# EAGLE board Tello_Power_PCB (EAGLE 9.6.2)
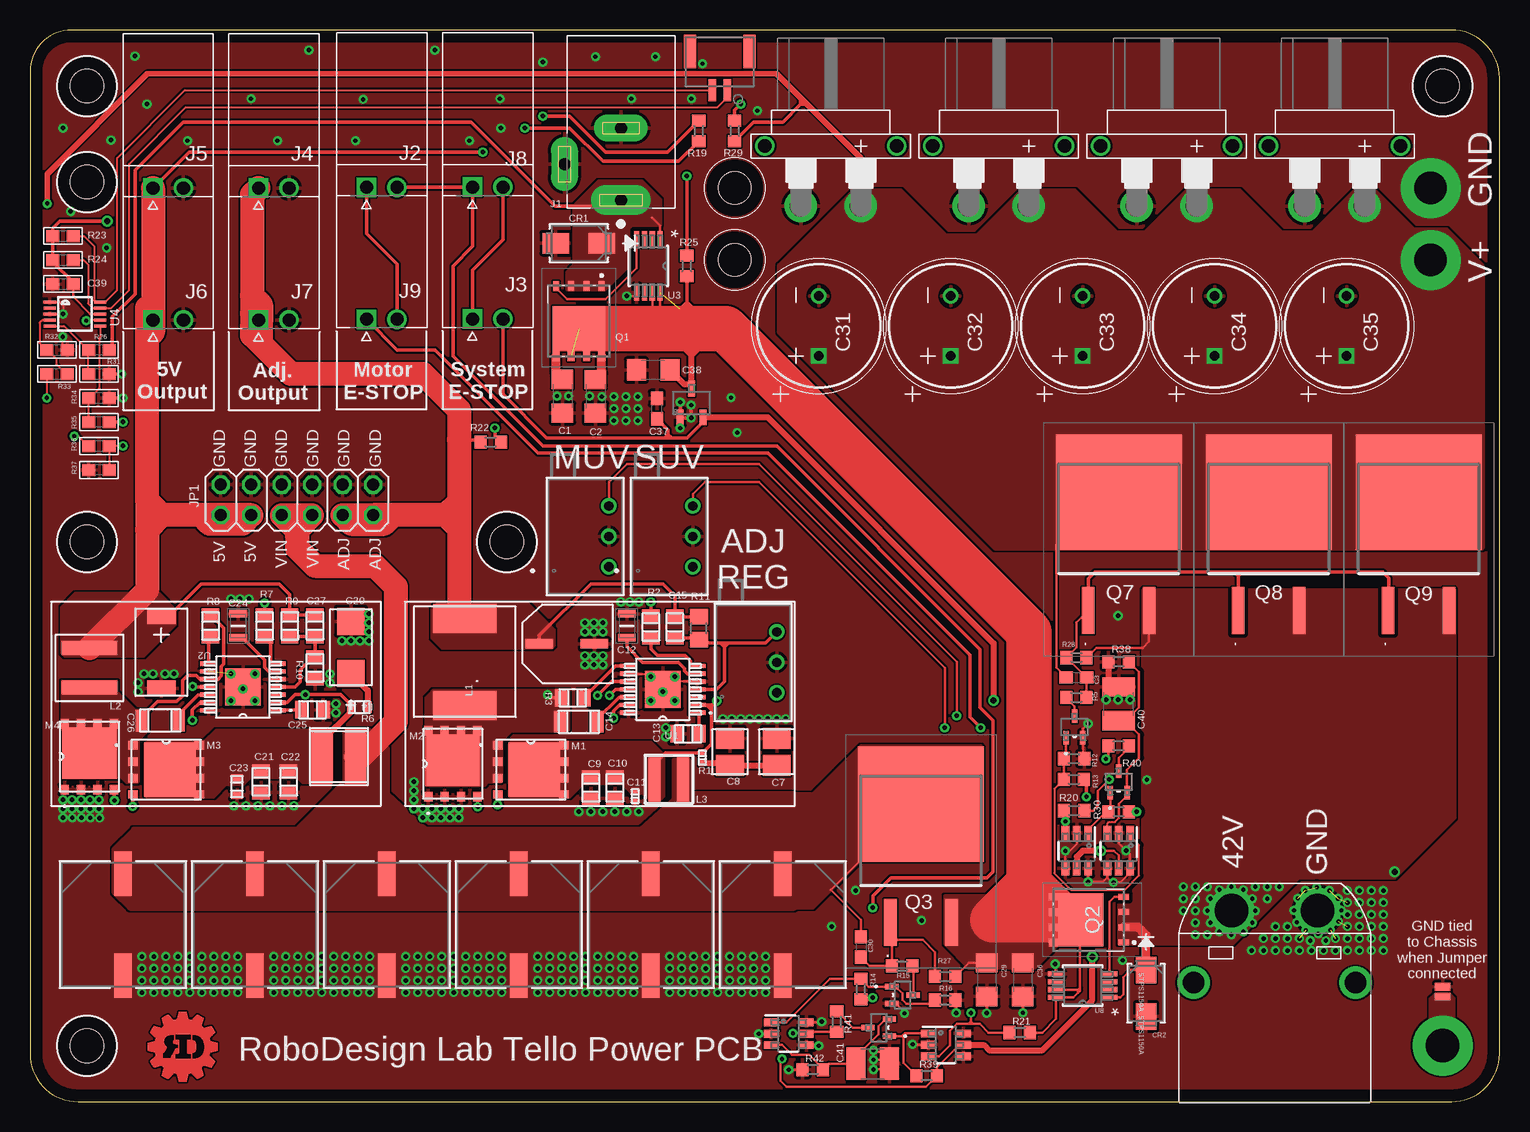
[diagram p6: board, top side]
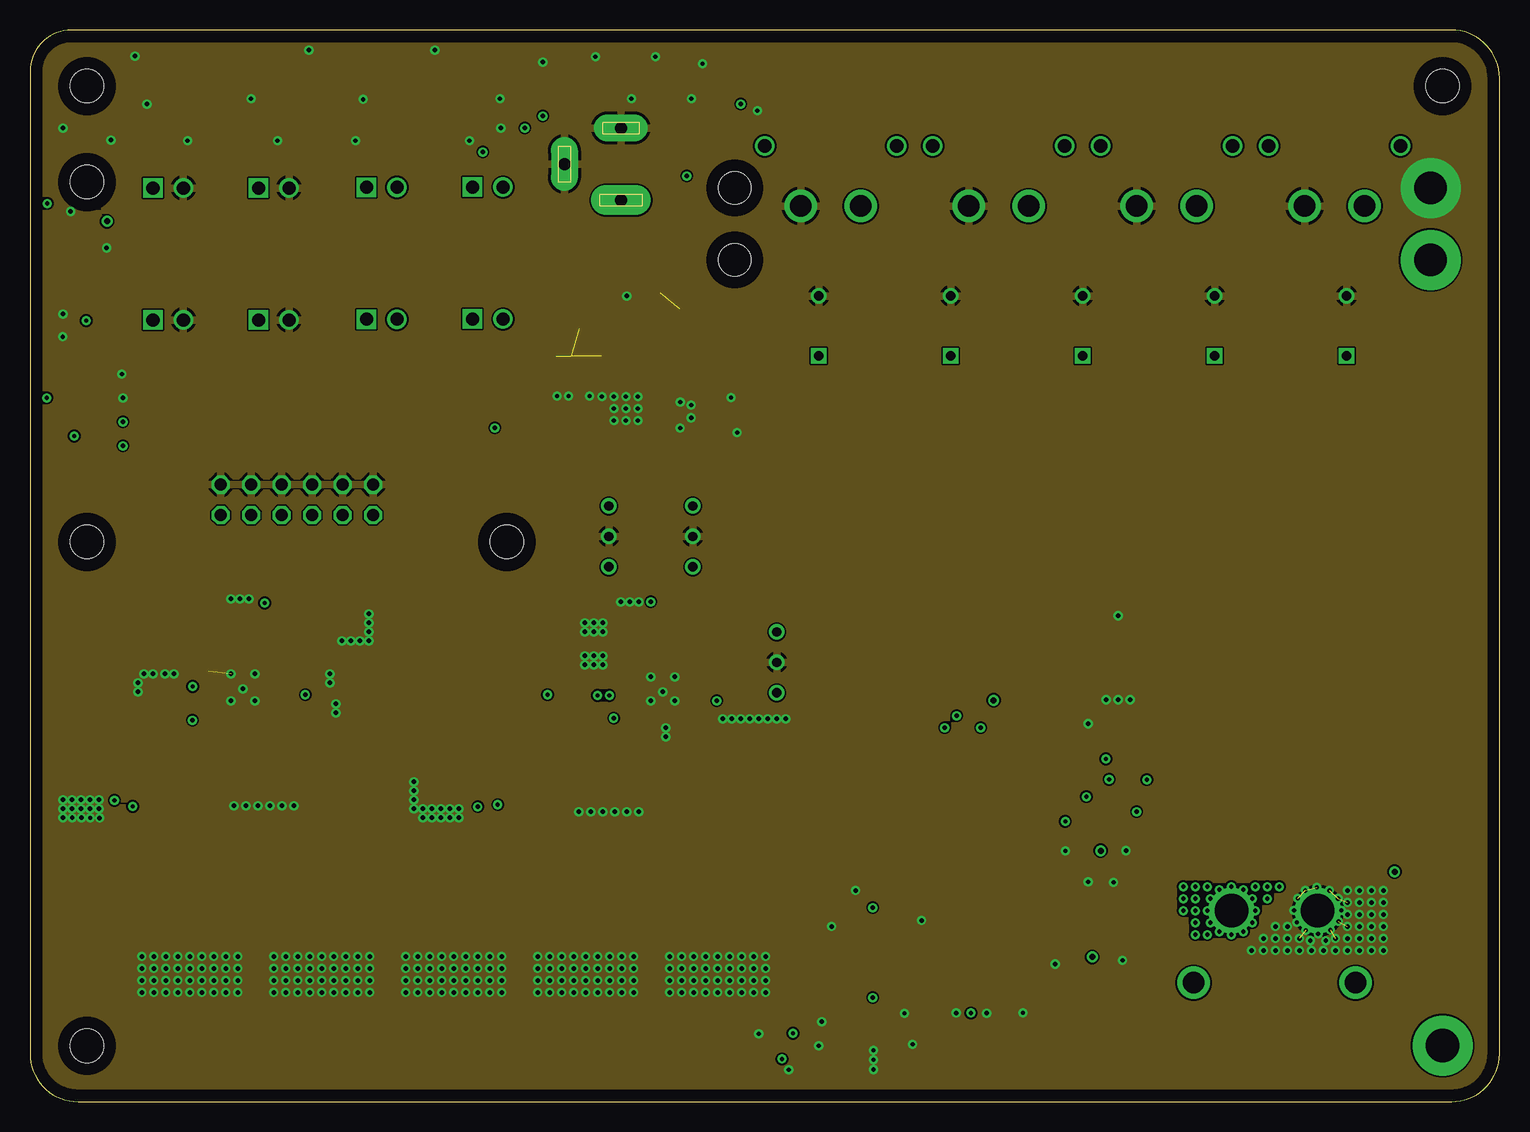
[diagram p7: board, inner layer Route2]
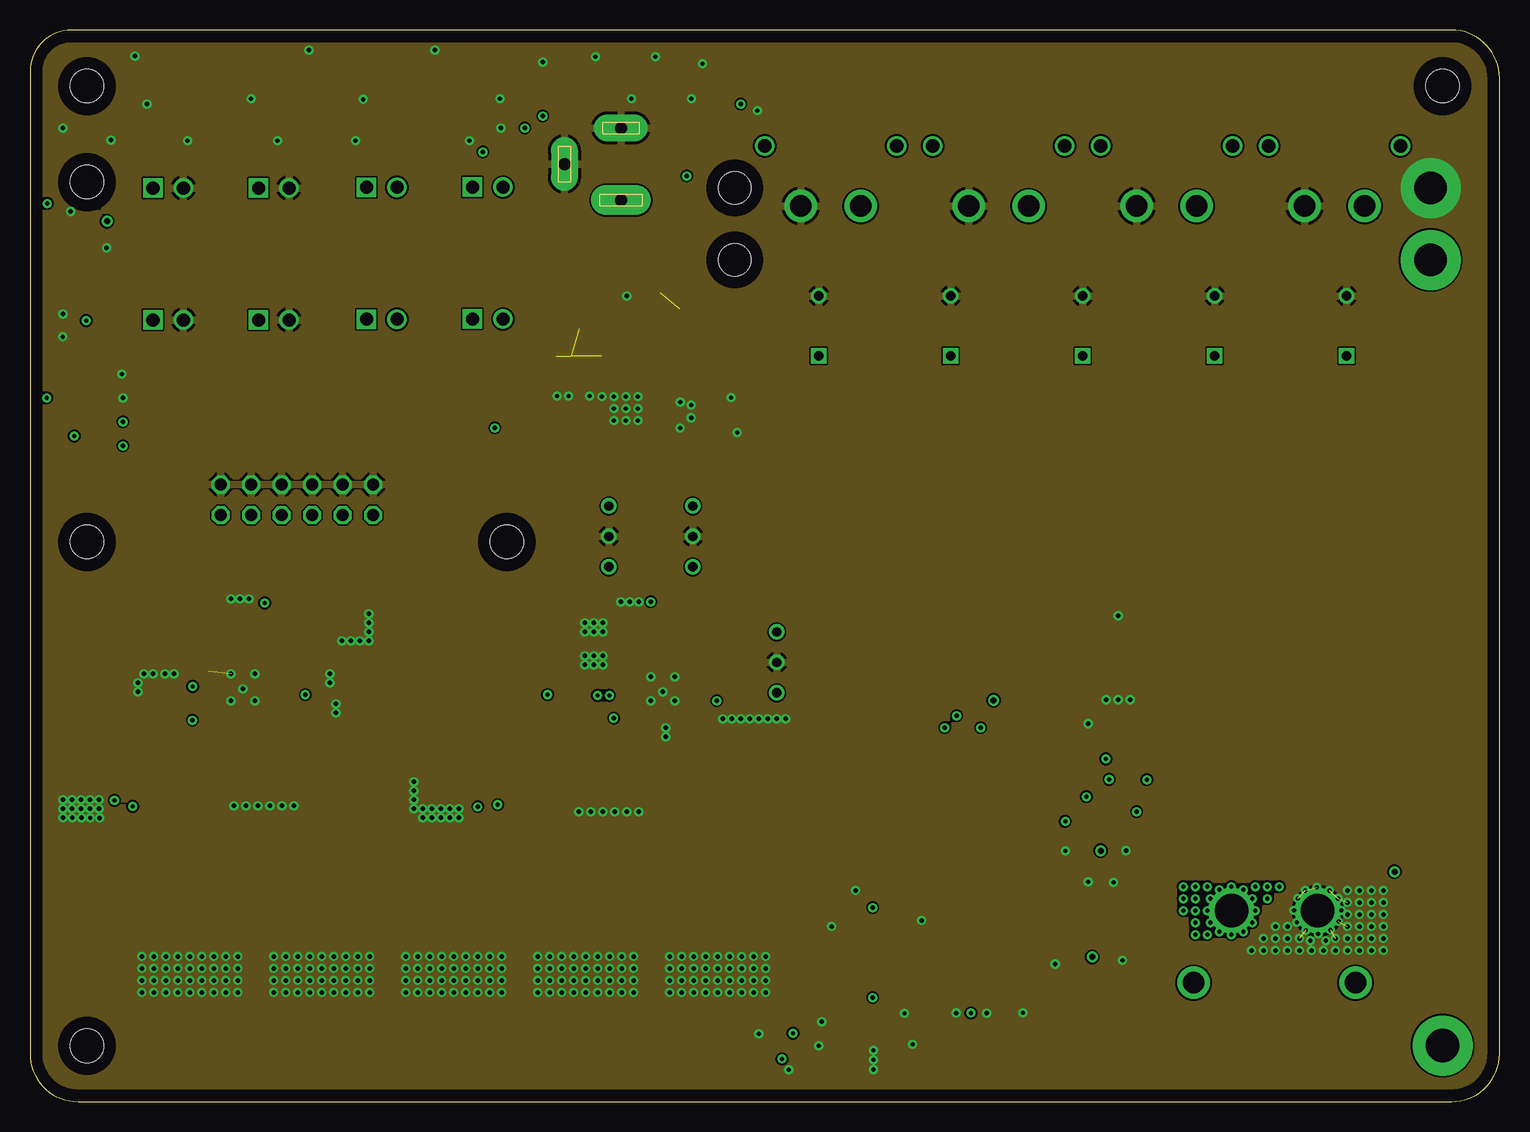
[diagram p8: board, inner layer Route15]
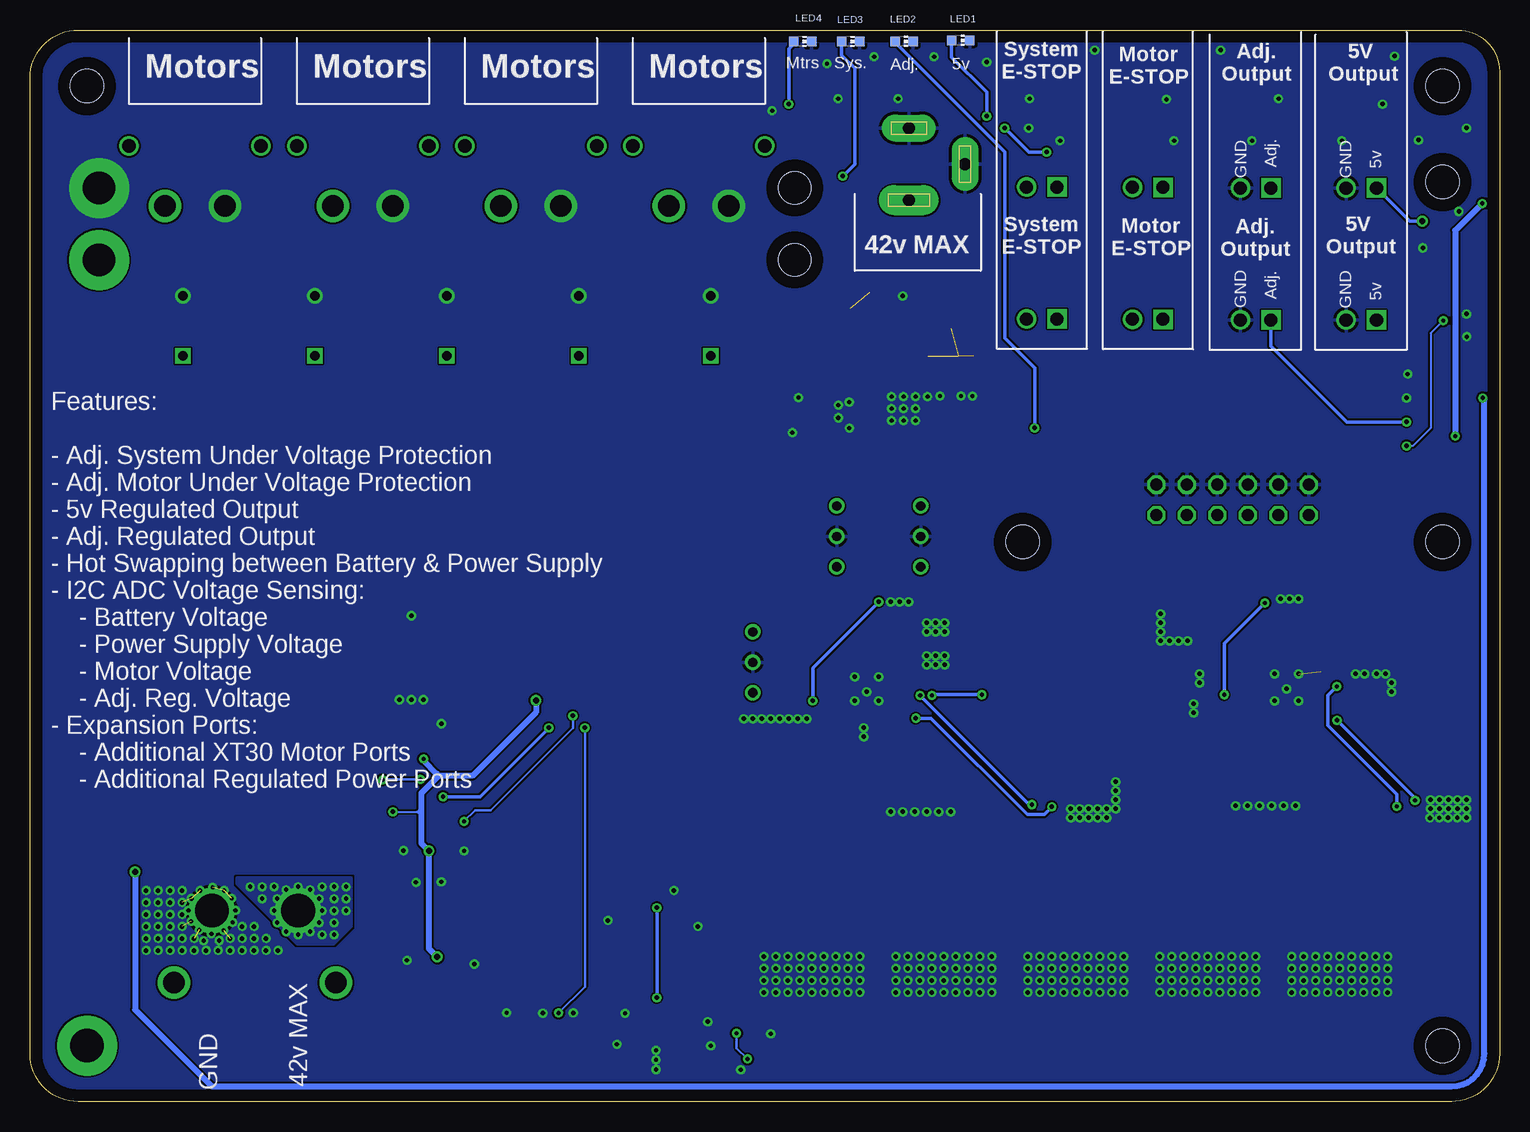
[diagram p9: board, bottom side, seen from below]

Size 122.5 x 89.35 mm. Coordinates in mm from the lower left corner, seen from the top.
Outline: 4,0 118.5,0 arc90 122.5,4 122.5,85.35 arc90 118.5,89.35 3.47,89.35 arc90 0,85.88 0,4 arc90 4,0
Copper layers (1+2*15+16): Top 0.035mm / dielectric 1.5mm / Route2 0.035mm / dielectric 0.15mm / Route15 0.035mm / dielectric 0.2mm / Bottom 0.035mm
Design rules "default *": minimum track width 6mil, minimum drill 0.35mm, track to track 6mil, track to pad 6mil, pad to pad 6mil, via to via 6mil, smd to smd 6mil, copper to edge 40mil, drill to drill 6mil, minimum pad ring 10mil, minimum via ring 8mil, stop-mask expansion 4mil, vias tented up to drill 20mil, thermal gap 10mil
Holes 2.8 mm at 4.75,84.67 117.75,84.67 4.75,4.67 4.75,76.67 4.75,46.67 39.75,46.67
Holes 2.7 mm at 58.75,70.17 58.75,76.17

## Footprints (pad centres in the part's own frame; a part is rotated, then mirrored left to right if it is on the bottom)
RCL_C1206 = smd 1.6 x 1.8: 1 -1.4,0; 2 1.4,0
RCL_C0603 = smd 1.1 x 1: 1 -0.85,0; 2 0.85,0
PCR1H820MCL1GS_CAP_PC_10X8_NCH = smd 3.702 x 1.492: 1 -4.25,0; 2 4.25,0
12V--LM3150_3528-21 = smd 1.753 x 2.311: 1 -1.13,0; 2 1.13,0
12V--LM3150_0805:1 = smd 1.118 x 1.448: 1 -0.902,0; 2 0.902,0
12V--LM3150_0402 = smd 0.559 x 0.61: 1 -0.419,0; 2 0.419,0
CGA4F2C0G1H153J085AA_CAPC2012X100N = smd 0.62 x 1.47: 1 -1,0; 2 1,0
12V--LM3150_1206:1 = smd 1.118 x 1.803: 1 -1.499,0; 2 1.499,0
12V--LM3150_PCV1E330MCL1GS = smd 2.3 x 0.8: P$1 2.3,0; P$3 -2.3,0
5V-LM3150MH_6032-28 = smd 2.261 x 2.311: 1 -2.172,0; 2 2.172,0
5V-LM3150MH_0805 = smd 1.118 x 1.448: 1 -0.902,0; 2 0.902,0
5V-LM3150MH_0603 = smd 0.66 x 0.965: 1 -0.699,0; 2 0.699,0
5V-LM3150MH_1206 = smd 1.118 x 1.803: 1 -1.499,0; 2 1.499,0
5V-LM3150MH_C2917 = smd 1.3 x 2.4: P$1 0,0; P$2 6,0
227AVG050MGBJ_CAPPRD500W60D1025H1350 = drill 0.8 pad 1.2 square: 1 0,0 | drill 0.8 pad 1.2: 2 5,0
MICROBUILDER_0603:1 = smd 1.1 x 1: 1 -0.85,0; 2 0.85,0
RCL_C1210 = smd 1.6 x 2.7: 1 -1.4,0; 2 1.4,0
AMASS_XT30PW-F = drill 1.8: + 2.5,0; - -2.5,0 | drill 1.1: P$3 -5.5,5; P$4 5.5,5
AMASS_XT60PW-M = drill 2.8: + 3.6,0; - -3.6,0 | drill 1.8: P$3 -6.75,6; P$4 6.75,6
STPS1150A_SMA_STM = smd 2.21 x 1.702: 1 -1.93,0; 2 1.93,0
PJ-002A_CUI_PJ-002A = drill 1 pad 2.5 long: 1 0,0 | drill 1 pad 2.25 long: 2 6,0; 3 3,4.7
1719740002_MOLEX_1719740002 = drill 1.09 pad 1.44 square: 1 0,0 | drill 1.09 pad 1.44: 2 -2.54,0
SM02B-GHS-TB_CONN_SM02BGHSTB_JST = smd 0.66 x 1.803: 1 -0.625,2.345; 2 0.625,2.345 | smd 0.991 x 2.794: 3 -2.475,-0.865; 4 2.475,-0.865
PINHEAD_2X06 = drill 1.016 octagon: 1 -6.35,-1.27; 2 -6.35,1.27; 3 -3.81,-1.27; 4 -3.81,1.27; 5 -1.27,-1.27; 6 -1.27,1.27; 7 1.27,-1.27; 8 1.27,1.27; 9 3.81,-1.27; 10 3.81,1.27; 11 6.35,-1.27; 12 6.35,1.27
SPARKFUN-JUMPERS_SMT-JUMPER_2_NC_PASTE_NO-SILK = smd 0.635 x 1.27: 1 -0.406,0; 2 0.406,0
12V--LM3150_WE-LHMI_8040 = smd 2.42 x 5.33: 1 -3.62,0; 2 3.62,0
5V-LM3150MH_XAL5030 = smd 1.168 x 4.648: 1 -1.651,0; 2 1.651,0
XAL4030-332MEB_XAL4030-332MEB = smd 0.98 x 3.7: 1 -1.185,0; 2 1.185,0
5V-LM3150MH_IND_NPI43C = smd 1.753 x 4.496: 1 -1.397,0; 2 1.397,0
LED_CHIP-LED0603 = smd 0.8 x 0.8: A 0,-0.75; C 0,0.75
12V--LM3150_TRANS_NEXFET_Q5A:1 = smd 0.8 x 0.7: 1 -2.752,2.055; 2 -2.752,0.685; 3 -2.752,-0.685; 4 -2.752,-2.055; 5 2.752,-2.055; 6 2.752,-0.685; 7 2.752,0.685; 8 2.752,2.055 | smd 4.3 x 4.56: 9 0.3,0
5V-LM3150MH_TRANS_NEXFET_Q5A = smd 0.8 x 0.7: 1 -2.752,2.055; 2 -2.752,0.685; 3 -2.752,-0.685; 4 -2.752,-2.055; 5 2.752,-2.055; 6 2.752,-0.685; 7 2.752,0.685; 8 2.752,2.055 | smd 4.3 x 4.56: 9 0.3,0
BSC027N06LS5ATMA1_BSC027N06LS5ATMA1 = smd 0.5 x 0.85: 1 -1.905,-2.913; 2 -0.635,-2.913; 3 0.635,-2.913; 4 1.905,-2.913 | smd 0.6 x 0.8: 5 1.905,2.913; 6 0.635,2.913; 7 -0.635,2.913; 8 -1.905,2.913 | smd 4.41 x 3.75: 9 0,0.637
IXTA96P085T_IXTA96P085T = smd 3.95 x 1.05: 1 -12.221,2.54; 3 -12.221,-2.54 | smd 9.6 x 10.5: 4 -2.371,0
68XR10KLF_RES3_68X_TTE = drill 0.762 pad 1.27: 1 5.08,0; 2 2.54,0; 3 0,0
RCL_R0603 = smd 1 x 1.1: 1 -0.85,0; 2 0.85,0
RCL_R0805 = smd 1.3 x 1.5: 1 -0.95,0; 2 0.95,0
5V-LM3150MH_MXA14A = smd 1.422 x 0.356: 1 -2.845,1.95; 2 -2.845,1.3; 3 -2.845,0.65; 4 -2.845,0; 5 -2.845,-0.65; 6 -2.845,-1.3; 7 -2.845,-1.95; 8 2.845,-1.95; 9 2.845,-1.3; 10 2.845,-0.65; 11 2.845,0; 12 2.845,0.65; 13 2.845,1.3; 14 2.845,1.95 | smd 2.997 x 3.099: 15 0,0
LTC4357_MSOP-8_MS_LIT = smd 1.359 x 0.432: 1 -2.229,0.975; 2 -2.229,0.325; 3 -2.229,-0.325; 4 -2.229,-0.975; 5 2.229,-0.975; 6 2.229,-0.325; 7 2.229,0.325; 8 2.229,0.975
MICROBUILDER_MSOP10 = smd 0.25 x 1: 1 -1,-2.113; 2 -0.5,-2.113; 3 0,-2.113; 4 0.5,-2.113; 5 1,-2.113; 6 1,2.113; 7 0.5,2.113; 8 0,2.113; 9 -0.5,2.113; 10 -1,2.113
DMN67D8LW-13_DMN67D8LW-13_DIO = smd 0.457 x 1.118: 1 -0.7,-0.897; 2 0.7,-0.897; 3 0,0.897
TLV6713DDC_DDC0006A_M = smd 1.2 x 0.65: GND 1.475,0.95; GND@1 1.475,-0.95; GND@2 -1.475,0; OUT -1.475,0.95; SENSE -1.475,-0.95; VCC 1.475,0
MCP1792T-5002H_SOT-23A_CB_MCH = smd 0.568 x 1.31: 1 -0.95,-1.194; 2 0.95,-1.194; 3 0,1.194

## Placement (x,y rotation side)
C1  10uF 50v  [RCL_C1206]  44.39,58.82 270 top
C2  10uF 50v  [RCL_C1206]  47.13,58.8 270 top
C3  47nF  [RCL_C0603]  87.23,35.35 0 top
C4  PCR1H820MCL1GS_PCR1H820MCL1GS  [PCR1H820MCL1GS_CAP_PC_10X8_NCH]  7.75,14.77 270 top
C5  PCR1H820MCL1GS_PCR1H820MCL1GS  [PCR1H820MCL1GS_CAP_PC_10X8_NCH]  18.75,14.77 270 top
C6  PCR1H820MCL1GS_PCR1H820MCL1GS  [PCR1H820MCL1GS_CAP_PC_10X8_NCH]  29.75,14.77 270 top
C7  2.2uF  [12V--LM3150_3528-21]  62.25,29.17 90 top
C8  2.2uF  [12V--LM3150_3528-21]  58.35,29.17 90 top
C9  15uF  [12V--LM3150_0805:1]  46.75,26.17 270 top
C10  15uF  [12V--LM3150_0805:1]  48.75,26.17 270 top
C11  100nF  [12V--LM3150_0402]  50.45,25.47 270 top
C12  15nF  [CGA4F2C0G1H153J085AA_CAPC2012X100N]  49.75,39.67 90 top
C13  2.2uF  [12V--LM3150_0805:1]  54.85,30.67 180 top
C14  470nF  [12V--LM3150_1206:1]  45.75,31.67 180 top
C15  300pF  [12V--LM3150_0805:1]  53.75,39.57 270 top
C16  30.073uF 58.181mOhm  [12V--LM3150_PCV1E330MCL1GS]  44.75,38.17 180 top
C17  PCR1H820MCL1GS_PCR1H820MCL1GS  [PCR1H820MCL1GS_CAP_PC_10X8_NCH]  40.75,14.77 270 top
C18  PCR1H820MCL1GS_PCR1H820MCL1GS  [PCR1H820MCL1GS_CAP_PC_10X8_NCH]  51.75,14.77 270 top
C19  PCR1H820MCL1GS_PCR1H820MCL1GS  [PCR1H820MCL1GS_CAP_PC_10X8_NCH]  62.75,14.77 270 top
C20  3.3uF  [5V-LM3150MH_6032-28]  26.75,37.88 90 top
C21  10uF  [5V-LM3150MH_0805]  19.25,26.67 270 top
C22  10uF  [5V-LM3150MH_0805]  21.55,26.67 270 top
C23  100nF  [5V-LM3150MH_0603]  17.25,26.27 270 top
C24  15nF  [CGA4F2C0G1H153J085AA_CAPC2012X100N]  17.35,39.67 90 top
C25  2.2uF  [5V-LM3150MH_0805]  23.55,32.67 0 top
C26  470nF  [5V-LM3150MH_1206]  10.85,31.77 180 top
C27  62pF  [5V-LM3150MH_0805]  23.75,39.67 270 top
C28  EEF-CX0J151XR  [5V-LM3150MH_C2917]  10.95,40.47 270 top
C29  10uF 50v  [RCL_C1206]  79.75,10.17 270 top
C30  47nF  [RCL_C0603]  69.26,12.9 270 top
C31  227AVG050MGBJ_227AVG050MGBJ  [227AVG050MGBJ_CAPPRD500W60D1025H1350]  65.75,62.17 90 top
C32  227AVG050MGBJ_227AVG050MGBJ  [227AVG050MGBJ_CAPPRD500W60D1025H1350]  76.75,62.17 90 top
C33  227AVG050MGBJ_227AVG050MGBJ  [227AVG050MGBJ_CAPPRD500W60D1025H1350]  87.75,62.17 90 top
C34  227AVG050MGBJ_227AVG050MGBJ  [227AVG050MGBJ_CAPPRD500W60D1025H1350]  98.75,62.17 90 top
C35  227AVG050MGBJ_227AVG050MGBJ  [227AVG050MGBJ_CAPPRD500W60D1025H1350]  109.75,62.17 90 top
C36  10uF 50v  [RCL_C1206]  82.75,10.17 270 top
C37  2.2uF  [RCL_C0603]  52.27,57.78 90 top
C38  2.2uF  [RCL_C1206]  51.95,61 180 top
C39  10µF  [MICROBUILDER_0603:1]  2.75,68.17 0 top
C40  220uF  [RCL_C1210]  90.75,33.17 90 top
C41  220uF  [RCL_C1210]  70.25,3.17 0 top
CON1  AMASS_XT30PW-F  [AMASS_XT30PW-F]  66.75,74.67 0 top
CON2  AMASS_XT30PW-F  [AMASS_XT30PW-F]  80.75,74.67 0 top
CON3  AMASS_XT30PW-F  [AMASS_XT30PW-F]  94.75,74.67 0 top
CON4  AMASS_XT30PW-F  [AMASS_XT30PW-F]  108.75,74.67 0 top
CON7  AMASS_XT60PW-M  [AMASS_XT60PW-M]  103.75,15.92 180 top
CR1  STPS1150A_STPS1150A  [STPS1150A_SMA_STM]  45.75,71.57 180 top
CR2  STPS1150A_STPS1150A  [STPS1150A_SMA_STM]  93.04,9.04 270 top
J1  PJ-002A_PJ-002A  [PJ-002A_CUI_PJ-002A]  49.25,75.17 90 top
J2  1719740002_1719740002  [1719740002_MOLEX_1719740002]  28.05,76.23 180 top
J3  1719740002_1719740002  [1719740002_MOLEX_1719740002]  36.89,65.25 180 top
J4  1719740002_1719740002  [1719740002_MOLEX_1719740002]  19.05,76.17 180 top
J5  1719740002_1719740002  [1719740002_MOLEX_1719740002]  10.25,76.17 180 top
J6  1719740002_1719740002  [1719740002_MOLEX_1719740002]  10.25,65.17 180 top
J7  1719740002_1719740002  [1719740002_MOLEX_1719740002]  19.05,65.17 180 top
J8  1719740002_1719740002  [1719740002_MOLEX_1719740002]  36.89,76.25 180 top
J9  1719740002_1719740002  [1719740002_MOLEX_1719740002]  28.05,65.23 180 top
J10  SM02B-GHS-TB_SM02BGHSTBLFSN  [SM02B-GHS-TB_CONN_SM02BGHSTB_JST]  57.5,86.67 180 top
JP1  [PINHEAD_2X06]  22.25,50.17 0 top
JP2  SPARKFUN-JUMPERS_JUMPER-SMT_2_NC_PASTE_NO-SILK  [SPARKFUN-JUMPERS_SMT-JUMPER_2_NC_PASTE_NO-SILK]  117.75,9.17 90 top
L1  8.2uH  [12V--LM3150_WE-LHMI_8040]  36.25,36.67 90 top
L2  2.2uH  [5V-LM3150MH_XAL5030]  4.95,36.17 90 top
L3  3.3uH  [XAL4030-332MEB_XAL4030-332MEB]  53.25,26.87 180 top
L4  3.9uH  [5V-LM3150MH_IND_NPI43C]  25.75,28.77 180 top
LED1  [LED_CHIP-LED0603]  44.91,88.48 270 bottom
LED2  [LED_CHIP-LED0603]  49.63,88.41 270 bottom
LED3  [LED_CHIP-LED0603]  54.09,88.39 270 bottom
LED4  [LED_CHIP-LED0603]  58.09,88.39 270 bottom
M1  30V  [12V--LM3150_TRANS_NEXFET_Q5A:1]  41.75,27.67 0 top
M2  60V  [12V--LM3150_TRANS_NEXFET_Q5A:1]  35.25,28.17 90 top
M3  30V  [5V-LM3150MH_TRANS_NEXFET_Q5A]  11.35,27.67 0 top
M4  60V  [5V-LM3150MH_TRANS_NEXFET_Q5A]  4.95,28.77 90 top
Q1  BSC027N06LS5ATMA1_BSC027N06LS5ATMA1  [BSC027N06LS5ATMA1_BSC027N06LS5ATMA1]  45.75,65.08 180 top
Q2  BSC027N06LS5ATMA1_BSC027N06LS5ATMA1  [BSC027N06LS5ATMA1_BSC027N06LS5ATMA1]  88.25,15.17 90 top
Q3  IXTA96P085T_IXTA96P085T  [IXTA96P085T_IXTA96P085T]  74.27,27.17 90 top
Q7  IXTA96P085T_IXTA96P085T  [IXTA96P085T_IXTA96P085T]  90.75,53.17 90 top
Q8  IXTA96P085T_IXTA96P085T  [IXTA96P085T_IXTA96P085T]  103.25,53.17 90 top
Q9  IXTA96P085T_IXTA96P085T  [IXTA96P085T_IXTA96P085T]  115.75,53.17 90 top
R1  1  [12V--LM3150_0402]  56.05,28.67 270 top
R2  332k  [12V--LM3150_0805:1]  51.75,39.57 270 top
R3  1.37k  [12V--LM3150_0805:1]  45.25,33.67 0 top
R4  68XR10KLF_68XR10KLF  [68XR10KLF_RES3_68X_TTE]  62.25,39.17 270 top
R5  3.6K  [RCL_R0603]  87.23,33.69 0 top
R6  100m  [5V-LM3150MH_0603]  27.45,32.88 0 top
R7  51.1k  [5V-LM3150MH_0805]  19.55,39.67 270 top
R8  1.58k  [5V-LM3150MH_0805]  15.05,39.67 270 top
R9  73.2k  [5V-LM3150MH_0805]  21.65,39.67 270 top
R10  10k  [5V-LM3150MH_0805]  23.75,36.17 270 top
R11  33k  [RCL_R0805]  55.75,39.47 90 top
R12  2K  [RCL_R0603]  87.03,28.59 0 top
R13  1K  [RCL_R0603]  87.02,26.86 0 top
R14  1K  [RCL_R0603]  69.26,9.39 270 top
R15  3.6K  [RCL_R0603]  72.71,11.32 180 top
R16  2K  [RCL_R0603]  76.3,8.47 0 top
R17  68XR10KLF_68XR10KLF  [68XR10KLF_RES3_68X_TTE]  48.25,49.67 270 top
R18  68XR10KLF_68XR10KLF  [68XR10KLF_RES3_68X_TTE]  55.25,49.67 270 top
R19  1K  [RCL_R0603]  55.75,80.94 90 top
R20  100K  [RCL_R0603]  87.04,24.26 0 top
R21  100K  [RCL_R0603]  82.51,5.77 0 top
R22  5K  [RCL_R0603]  38.41,54.98 0 top
R23  10K  [MICROBUILDER_0603:1]  2.75,72.17 0 top
R24  10K  [MICROBUILDER_0603:1]  2.75,70.17 0 top
R25  2K  [RCL_R0603]  54.75,69.67 90 top
R26  10K  [MICROBUILDER_0603:1]  5.75,62.67 180 top
R27  2K  [RCL_R0603]  76.3,10.45 180 top
R28  2K  [RCL_R0603]  87.23,37.02 180 top
R29  2K  [RCL_R0603]  58.74,80.94 90 top
R30  1K  [RCL_R0603]  90.75,24.17 0 top
R31  1K  [MICROBUILDER_0603:1]  5.75,60.67 0 top
R32  1K  [MICROBUILDER_0603:1]  2.25,62.67 0 top
R33  10K  [MICROBUILDER_0603:1]  2.25,60.67 0 top
R34  1K  [MICROBUILDER_0603:1]  5.75,58.67 0 top
R35  10K  [MICROBUILDER_0603:1]  5.75,56.67 180 top
R36  10K  [MICROBUILDER_0603:1]  5.75,54.67 0 top
R37  1K  [MICROBUILDER_0603:1]  5.75,52.67 180 top
R38  62K  [RCL_R0603]  90.75,36.67 0 top
R39  1K  [RCL_R0603]  74.75,2.17 0 top
R40  100R  [RCL_R0603]  90.74,29.67 180 top
R41  100R  [RCL_R0603]  67.25,6.67 270 top
R42  62K  [RCL_R0603]  65.25,2.67 0 top
U1  5V-LM3150MH_LM3150MH/NOPB  [5V-LM3150MH_MXA14A]  52.75,34.38 180 top
U2  5V-LM3150MH_LM3150MH/NOPB  [5V-LM3150MH_MXA14A]  17.75,34.57 180 top
U3  LTC4357_LTC4357CMS8TRPBF  [LTC4357_MSOP-8_MS_LIT]  51.55,69.67 270 top
U4  ADS1015IDGST  [MICROBUILDER_MSOP10]  3.75,65.67 270 top
U5  DMN67D8LW-13_DMN67D8LW-13  [DMN67D8LW-13_DMN67D8LW-13_DIO]  90.75,26.67 0 top
U6  DMN67D8LW-13_DMN67D8LW-13  [DMN67D8LW-13_DMN67D8LW-13_DIO]  72.74,8.89 270 top
U7  DMN67D8LW-13_DMN67D8LW-13  [DMN67D8LW-13_DMN67D8LW-13_DIO]  87.07,31.24 0 top
U8  LTC4357_LTC4357CMS8TRPBF  [LTC4357_MSOP-8_MS_LIT]  87.75,9.67 180 top
U9  TLV6713DDC_TLV6713DDCTDDC0006A_M  [TLV6713DDC_DDC0006A_M]  76.35,4.73 0 top
U10  TLV6713DDC_TLV6713DDCTDDC0006A_M  [TLV6713DDC_DDC0006A_M]  87.25,20.92 270 top
U11  TLV6713DDC_TLV6713DDCTDDC0006A_M  [TLV6713DDC_DDC0006A_M]  90.75,20.92 270 top
U12  DMN67D8LW-13_DMN67D8LW-13  [DMN67D8LW-13_DMN67D8LW-13_DIO]  70.75,6.17 90 top
U13  MCP1792T-5002H_MCP1792T-5002H/CB  [MCP1792T-5002H_SOT-23A_CB_MCH]  55.15,58.25 0 top
U14  TLV6713DDC_TLV6713DDCTDDC0006A_M  [TLV6713DDC_DDC0006A_M]  63.25,5.67 0 top

## Tracks (layer width: path | path; a pad name or v marks a point on that pad's centre or on a via)
5V  (via drill 0.35, 0.5)
  Top 0.203: C39.2 3.6,67.1 5.03,65.67 U4.8
  Top 0.305: C39.2 3.6,68.31 1.9,70.02 R24.1 R23.1 1.9,72.82 2.48,73.41 v6.43,73.41 | J5.1 13.25,79.17 v37.75,79.17 | v41.25,81.17 44.99,81.17 47.76,78.41 54.07,78.41 R19.1 | C27.1 R9.1 21.65,42.27 20.75,43.17 14.25,43.17 11.55,40.47 C28.P$1
  Top 2: 9.75,50.13 9.75,47.67 | 9.75,47.67 9.75,42.63 L2.2 | 14.25,48.91 JP1.1 JP1.3 17.71,48.17 14.98,48.17 14.25,48.91 | 14.25,48.91 10.98,48.91 | 10.98,48.91 9.75,47.67 | 10.98,48.91 9.75,50.13 | 9.75,50.13 9.75,63.67 | 9.75,63.67 9.75,64.67 | J5.1 10.25,66.67 | 10.25,66.67 J6.1 | J6.1 9.75,64.67 | 9.75,64.67 9.75,66.17 10.25,66.67 | J6.1 10.25,64.17 9.75,63.67
  Bottom 0.305: v6.43,73.41 7.48,73.41 J5.1 | v37.75,79.17 39.25,79.17 v41.25,81.17
  pour Top (no thermals): 2.63,41.21 2.63,37.41 2.89,37.16 9.48,37.16 12.11,39.78 12.11,41.02 10.75,42.38 3.79,42.38
5V_ALWAYS_ON  (via drill 0.35, 0.5)
  Top 0.152: R30.2 v92.25,24.17
  Top 0.203: U9.VCC 77.61,4.52 77.24,4.52 75.6,2.88 R39.2 74.68,1.25 63.05,1.25 62.57,1.73 62.57,3.45 v62.69,3.56 | v63.6,5.7 64.7,5.7 U14.VCC 64.88,5.82 R41.2 | U11.VCC 90.75,20.52 90.35,20.92 v89.25,20.92 | R40.2 89.89,28.77 v89.69,28.57
  Top 0.305: J3.2 39.43,58.99 43.08,55.34 52.9,55.34 | U13.2 56.1,56.65 54.79,55.34 53.48,55.34 | 52.9,55.34 53.2,55.34 | 53.2,55.34 53.48,55.34 | C37.1 53.2,56 53.2,55.64 | 53.2,55.64 53.2,55.63 | 53.2,55.34 53.2,55.63 | 52.9,55.34 53.2,55.64 | 53.2,55.63 53.48,55.35 53.48,55.34
  Top 0.508: U13.2 61.49,57.06 80.33,38.22 v80.33,33.46 | v89.25,20.92 87.75,20.92 87.25,20.42 U10.VCC | U9.VCC 79.52,4.73 79.98,4.27 84.34,4.27 88.55,8.47 v88.55,12.06
  Bottom 0.152: v92.25,24.17 90.25,24.17 90.21,24.17 | 90.21,24.17 89.88,24.17 | 90.21,24.17 89.88,24.5 | 90.21,24.17 89.88,23.84
  Bottom 0.203: v62.69,3.56 63.6,4.47 v63.6,5.7
  Bottom 0.508: v80.33,33.46 80.33,32.46 85.62,27.17 88.43,27.17 | v88.55,12.06 89.25,12.77 v89.25,20.92 89.88,21.55 89.88,23.84 89.88,24.17 89.88,24.5 89.88,25.72 88.59,27.01 | 88.43,27.17 88.59,27.01 | v89.69,28.57 89.69,28.43 88.59,27.33 | 88.59,27.33 88.43,27.17 | 88.59,27.33 88.59,27.01
BATT_IN  (via drill 0.35, 0.5)
  Top 0.152: R33.1 v1.4,58.68 v1.39,58.67
  Top 0.203: U8.1 90.88,8.7 91.13,8.95 91.13,10.36 91.74,10.97 CR2.1 | R28.1 88.88,37.82 92.75,37.82 93.29,38.36 Q7.3 | R20.2 88.59,24.26 89.01,24.68 89.01,25.9 v89.96,26.85 v89.96,26.87
  Top 0.762: CR2.1 93.04,13.88 92.39,14.54 Q2.2
  Bottom 0.203: v89.96,26.87 93.08,26.87 v93.1,26.84
  Bottom 0.508: v113.75,19.17 113.75,7.67 107.34,1.27 4,1.27 3.53,1.31 3.07,1.43 2.63,1.64 2.27,1.89 1.89,2.27 1.64,2.63 1.44,3.07 1.31,3.53 1.27,4 1.27,58.55 v1.39,58.67
  other vias: 100.15,17.92 100.15,13.92 99.15,14.17 98.4,14.92 98.15,15.92 98.4,16.92 99.15,17.67 101.15,17.67 101.9,16.92 102.15,15.92 101.9,14.92 101.15,14.17 98.15,17.92 97.15,17.92 97.15,16.92 97.15,15.92 97.15,14.92 102.15,17.92 103.15,17.92 104.15,17.92 103.15,16.92 97.15,13.92 98.15,13.92 96.15,17.92 96.15,16.92 96.15,15.92
  pour Top (isolate 0.305, no thermals): 118.75,42.67 92.75,42.67 92.75,18.39 91.57,17.21 90.75,17.21 90.75,13.17 100.25,13.17 105.75,18.67 113.75,18.67 118.75,23.67
  pour Bottom (no thermals): 95.75,18.67 105.25,18.67 105.25,18.17 100.25,13.17 97.2,13.17 95.75,14.62
BATT_SENSE
  Top 0.152: U4.4 1.04,65.17 0.81,64.94 0.81,63.26 R32.1 1.45,62.67 2.19,61.93 2.19,61.52 3.03,60.67 R33.2
CHASSIS  (via drill 2.8 pad 5)
  other vias: 117.75,4.67
  pour Top (no thermals): 118.39,9.02 117.11,9.02 116.66,8.56 116.66,6.7 118.78,6.7 118.79,6.7 118.79,8.61
GND  (via drill 0.35, 2.7 pad 5)  (8 unrouted)
  Top 0.152: U4.3 v2.75,65.67 2.75,66.38 2.46,66.67 U4.1 | R32.2 2.73,63.04 v2.73,63.77 | 7.64,60.67 v7.66,60.66 | U10.GND@2 87.25,21.49 86.67,20.91 v86.32,20.91 86.3,20.89 U10.GND@1 | U10.GND v88.2,18.33 v88.21,18.32 | U1.9 51.5,35.67 v51.75,35.42 | R12.2 87.78,28.69 U7.2 87.77,31.09 88.2,31.51 v88.21,31.51 | U1.5 54.15,35.02 v53.75,35.42
  Top 0.203: U8.5 85.46,10.71 v85.46,11.47 | v49.75,67.17 50.54,67.17 50.58,67.21 U3.5 | U6.2 72.18,8.2 72.9,7.48 v72.9,7.36 | R16.2 77.21,8.41 v77.21,7.39 | C29.2 v79.75,7.38 | C36.2 v82.75,7.41 v82.76,7.4 | U9.GND@2 73.64,4.73 v73.58,4.79 | v70.32,4.29 70.44,4.17 71.25,4.17 71.65,3.77 C41.2 | v70.32,3.48 71.34,3.48 C41.2 | v70.32,2.68 71.21,2.68 71.48,2.41 71.65,2.57 C41.2 | R42.1 v63.25,2.67 | U14.GND@1 65.7,4.72 v65.75,4.67 | U14.GND 66,6.62 v66,6.67 | U14.GND@2 v60.75,5.67 | v88.2,18.33 89.44,18.33 89.8,18.7 U11.GND@1 89.8,18.67 90.19,18.28 v90.33,18.28 90.91,18.28 91.7,19.07 U11.GND 91.7,20.6 v91.37,20.93 90.75,21.55 U11.GND@2
  Top 0.305: R34.2 v7.75,58.67 | R31.2 7.64,60.67 | U13.1 v54.2,56.15 | U13.1 54.25,57.02 v55.12,57.02 v55.12,58.07 | v54.21,58.32 U13.1
  Top 0.508: R38.1 89.9,34.82 89.75,34.67 89.85,34.57 C40.2
  other vias: 16.75,35.67 18.75,35.67 17.75,34.42 18.75,33.42 16.75,33.42 10.25,35.67 11.25,35.67 12,35.67 9.5,35.67 9,34.92 9,34.17 16.75,41.92 17.5,41.92 18.25,41.92 17,24.67 18,24.67 19,24.67 20,24.67 21,24.67 22,24.67 25.5,33.17 25.5,32.42 25,35.67 25,34.92 26,38.42 26.75,38.42 27.5,38.42 28.25,38.42 28.25,39.17 28.25,39.92 28.25,40.67 2.75,25.17 3.5,25.17 4.25,25.17 5,25.17 5.75,25.17 2.75,24.42 3.5,24.42 4.25,24.42 5,24.42 5.75,24.42 32.75,24.42 33.5,24.42 34.25,24.42 35,24.42 35.75,24.42 35.75,23.67 35,23.67 34.25,23.67 33.5,23.67 32.75,23.67 32,24.42 32,25.17 32,25.92 32,26.67 53.75,33.42 51.75,33.42 52.75,34.17 49.25,41.67 50,41.67 50.75,41.67 46.25,39.17 47,39.17 47.75,39.17 47.75,37.17 47,37.17 46.25,37.17 46.25,36.42 47,36.42 47.75,36.42 46.25,39.92 47,39.92 47.75,39.92 53,31.17 53,30.42 57.75,31.92 58.5,31.92 59.25,31.92 60,31.92 60.75,31.92 61.5,31.92 62.25,31.92 63,31.92 107.27,17.88 107.38,14 109.3,15.96 105.37,15.96 105.68,16.96 106.32,17.6 108.33,17.6 109.04,16.93 109.08,15.02 108.4,14.31 106.35,14.27 105.6,14.95 116.75,76.17 45.75,24.17 46.75,24.17 47.75,24.17 48.75,24.17 49.75,24.17 50.75,24.17 109.83,17.6 110.83,17.6 110.83,16.6 109.83,16.6 109.83,15.6 110.83,15.6 110.83,14.6 109.83,14.6 111.83,17.6 111.83,16.6 111.83,15.6 111.83,14.6 112.83,17.6 112.83,16.6 112.83,15.6 112.83,14.6 43.93,58.82 44.9,58.82 46.65,58.82 47.67,58.79 48.67,56.79 48.67,57.79 48.67,58.79 49.67,58.79 50.67,58.79 50.67,57.79 49.67,57.79 49.67,56.79 50.67,56.79 2.75,23.68 3.51,23.67 4.29,23.67 5.03,23.66 5.8,23.64 9.33,12.1 10.33,12.1 11.33,12.1 12.33,12.1 13.33,12.1 14.33,12.1 15.33,12.1 16.33,12.1 17.33,12.1 9.33,9.1 10.33,9.1 11.33,9.1 12.33,9.1 13.33,9.1 14.33,9.1 15.33,9.1 16.33,9.1 17.33,9.1 9.33,10.1 10.33,10.1 11.33,10.1 12.33,10.1 13.33,10.1 14.33,10.1 15.33,10.1 16.33,10.1 17.33,10.1 9.33,11.1 10.33,11.1 11.33,11.1 12.33,11.1 13.33,11.1 14.33,11.1 15.33,11.1 16.33,11.1 17.33,11.1 20.33,12.1 21.33,12.1 22.33,12.1 23.33,12.1 24.33,12.1 25.33,12.1 26.33,12.1 27.33,12.1 28.33,12.1 20.33,9.1 21.33,9.1 22.33,9.1 23.33,9.1 24.33,9.1 25.33,9.1 26.33,9.1 27.33,9.1 28.33,9.1 20.33,10.1 21.33,10.1 22.33,10.1 23.33,10.1 24.33,10.1 25.33,10.1 26.33,10.1 27.33,10.1 28.33,10.1 20.33,11.1 21.33,11.1 22.33,11.1 23.33,11.1 24.33,11.1 25.33,11.1 26.33,11.1 27.33,11.1 28.33,11.1 31.33,12.1 32.33,12.1 33.33,12.1 34.33,12.1 35.33,12.1 36.33,12.1 37.33,12.1 38.33,12.1 39.33,12.1 31.33,9.1 32.33,9.1 33.33,9.1 34.33,9.1 35.33,9.1 36.33,9.1 37.33,9.1 38.33,9.1 39.33,9.1 31.33,10.1 32.33,10.1 33.33,10.1 34.33,10.1 35.33,10.1 36.33,10.1 37.33,10.1 38.33,10.1 39.33,10.1 31.33,11.1 32.33,11.1 33.33,11.1 34.33,11.1 35.33,11.1 36.33,11.1 37.33,11.1 38.33,11.1 39.33,11.1 42.33,12.1 43.33,12.1 44.33,12.1 45.33,12.1 46.33,12.1 47.33,12.1 48.33,12.1 49.33,12.1 50.33,12.1 42.33,9.1 43.33,9.1 44.33,9.1 45.33,9.1 46.33,9.1 47.33,9.1 48.33,9.1 49.33,9.1 50.33,9.1 42.33,10.1 43.33,10.1 44.33,10.1 45.33,10.1 46.33,10.1 47.33,10.1 48.33,10.1 49.33,10.1 50.33,10.1 42.33,11.1 43.33,11.1 44.33,11.1 45.33,11.1 46.33,11.1 47.33,11.1 48.33,11.1 49.33,11.1 50.33,11.1 53.33,12.1 54.33,12.1 55.33,12.1 56.33,12.1 57.33,12.1 58.33,12.1 59.33,12.1 60.33,12.1 61.33,12.1 53.33,9.1 54.33,9.1 55.33,9.1 56.33,9.1 57.33,9.1 58.33,9.1 59.33,9.1 60.33,9.1 61.33,9.1 53.33,10.1 54.33,10.1 55.33,10.1 56.33,10.1 57.33,10.1 58.33,10.1 59.33,10.1 60.33,10.1 61.33,10.1 53.33,11.1 54.33,11.1 55.33,11.1 56.33,11.1 57.33,11.1 58.33,11.1 59.33,11.1 60.33,11.1 61.33,11.1 112.83,13.6 111.83,13.6 110.83,13.6 109.83,13.6 108.83,13.6 112.83,12.6 111.83,12.6 110.83,12.6 109.83,12.6 108.83,12.6 107.83,12.6 106.83,12.6 105.83,12.6 105.83,13.6 104.83,13.6 104.83,12.6 103.83,12.6 102.83,12.6 101.83,12.6 102.83,13.6 103.83,13.6 103.83,14.6 104.83,14.6 108.01,13.42 106.73,13.43 8.75,87.17 9.75,83.17 6.75,80.17 2.75,81.17 23.25,87.67 33.75,87.67 42.75,86.67 39.25,81.17 39.17,83.62 18.42,83.62 55.13,83.61 60.63,82.61 36.63,80.11 20.63,80.11 13.13,80.11 27.13,80.11 27.78,83.56 6.38,71.19 3.38,74.22 56.06,86.55 58.95,55.78 58.43,58.69 68.83,17.6 74.33,15.1 66.83,14.6 47.13,87.11 52.13,87.11 50.13,83.61 89.71,33.52 90.71,33.52 91.71,33.52 90.71,40.52 91.08,11.78
  pour Top (rank 2, no thermals): 6.22,12.53 6.64,12.95 64.43,12.95 64.43,9.39 64.43,8.05 6.22,8.05
  pour Bottom (no thermals): 62,75.42 62,68.42 65.5,64.92 111.5,64.92 119.75,73.17 119.75,76.92 118,78.67 65.25,78.67
  pour Top (rank 5): -8.75,94.67 131.25,94.67 131.25,-5.33 -8.75,-5.33
  pour Route2 (rank 5): -7.75,93.67 132.25,93.67 132.25,-6.33 -7.75,-6.33
  pour Route15 (rank 5): -6.75,92.67 133.25,92.67 133.25,-7.33 -6.75,-7.33
  pour Bottom (rank 5): -5.75,91.67 134.25,91.67 134.25,-8.33 -5.75,-8.33
M_N_GATE
  Top 0.152: R13.1 85.39,26.08 85.39,19.05 86.77,17.67 91.25,17.67 92.44,18.86 92.44,21.41 91.7,22.15 U11.OUT
  Top 0.203: U7.1 86.37,28.78 R12.1 R13.1
MOTOR_PULLUP  (via drill 0.35)
  Top 0.305: J9.1 30.61,62.67 33.75,62.67 42.34,54.08 61.51,54.08 78.35,37.24 78.35,32.07 v79.25,31.17 | v88.07,25.42 88.07,26.4 88.2,26.53 R13.2
  Bottom 0.305: v79.25,31.17 85,25.42 v88.07,25.42
MOTOR_V+  (via drill 0.35, 2.7 pad 5)
  Top 0.152: v3.69,55.5 4.03,55.5 4.86,54.67 R36.1
  Top 0.203: C3.1 86.38,35.39 85.57,36.2 85.57,46.39 89.98,50.8 Q7.4
  Top 0.305: R29.1 60.33,81.67 62.75,81.67 64.23,83.16 | 64.23,83.16 64.25,83.17 | 64.5,83.42 64.25,83.17 | 64.23,83.16 64.23,83.69 | 64.25,83.17 64.28,83.15 64.78,83.15
  Top 0.457: CON1.+ 69.25,78.67 64.78,83.15 64.5,83.42 64.23,83.69 62.24,85.69 9.77,85.69 1.43,77.34 v1.43,74.88
  Bottom 0.508: v1.43,74.88 3.69,72.62 v3.69,55.5
  other vias: 116.75,70.17
  pour Top (isolate 0.381, no thermals): 80.5,46.17 62.5,64.17 62.5,69.67 68.75,75.92 72.5,75.92 76.25,72.17 79,72.17 82.75,75.92 87,75.92 90.5,72.42 93,72.42 96.5,75.92 100.75,75.92 104.25,72.42 107,72.42 110.5,75.92 112,75.92 115.25,72.67 118,72.67 121,69.67 121,46.17
N$1
  Top 0.203: U7.3 87.07,32.96 86.38,33.66 R5.1
N$2
  Top 0.305: R7.2 20.05,38.27 20.05,36.58 20.11,36.52 U2.7
N$3
  Top 0.203: U10.OUT 88.2,22.67 89.7,24.17 R30.1 90.05,24.32 U5.1
N$4
  Top 0.203: U3.4 50.58,69.5 47.99,66.91 44.75,66.91 43.84,67.82 Q1.4
N$5
  Top 0.305: U2.6 19.89,35.88 19.58,36.19 19.58,36.84 17.74,38.67 C24.1
N$6  (via drill 0.35)
  Top 0.305: R29.2 58.74,82.66 v59.25,83.17
  Bottom 0.152: LED4.A 58.84,88.18
  Bottom 0.305: v59.25,83.17 59.25,87.77 58.84,88.18
N$7
  Top 0.508: C20.1 28.15,34.3 R6.2
N$8  (via drill 0.35)
  Top 0.203: R21.1 79.89,5.77 79.17,6.48 78.69,6.48 78.65,6.48 | 78.65,6.48 78.23,6.48 | 78.23,6.48 77.27,6.48 76.68,5.89 76.68,4.7 75.76,3.78 U9.SENSE | R18.3 55.25,50.67 56.25,51.67 60.75,51.67 76.25,36.17 v76.25,31.17 | v78.44,7.39 78.44,6.7 | 78.44,6.7 78.23,6.48 | 78.44,6.7 78.65,6.48
  Bottom 0.203: v76.25,31.17 76.25,9.58 v78.44,7.39
N$9  (via drill 0.35)
  Top 0.152: R20.1 86.3,24.15 v86.3,23.37 U10.SENSE
  Top 0.203: v77.25,32.17 77.25,36.67 60.75,53.17 49.75,53.17 48.25,51.67 R17.3
  Bottom 0.203: v77.25,32.17 77.25,31.17 84.12,24.3 85.39,24.3 86.3,23.39 v86.3,23.37
N$10
  Top 0.305: R8.2 14.91,38.63 U2.8
N$11
  Top 0.305: C26.1 12.35,32.24 14.03,33.92 U2.12
N$12
  Top 0.305: U2.1 20.65,32.67 C25.1
N$13  (via drill 0.35)
  Top 0.305: U2.11 13.62,34.57 v13.57,34.62 | v8.56,24.61 8.56,25.58 M3.4
  Bottom 0.305: v13.57,34.62 14.32,33.88 14.32,31.37 8.56,25.61 v8.56,24.61
N$14  (via drill 0.35)
  Top 0.305: U2.13 14.17,33.27 13.54,32.64 v13.54,31.8 | v7.04,25.12 7.04,25.99 M4.4
  Bottom 0.305: v13.54,31.8 7.04,25.3 v7.04,25.12
N$15
  Top 0.203: U6.3 73.64,11.25 R15.1
N$16
  Top 0.203: Q2.4 90.41,17.08 89.98,16.64 U8.4
N$17
  Top 0.508: R1.2 58.14,28.26 C8.1 C7.1
N$18
  Top 0.305: R9.2 C27.2 R10.1 23.59,37.08 22.53,36.02 22.53,35 22.1,34.57 U2.4
N$19
  Top 0.305: R2.2 51.75,37.77 52.32,37.19 54.6,37.19 55.06,36.73 55.06,36.38 55.12,36.32 U1.7
N$20
  Top 0.305: C12.1 49.75,37.94 51.07,36.61 54.06,36.61 54.56,36.11 54.56,35.91 54.8,35.67 U1.6
N$21
  Top 0.305: U1.8 48.81,36.32 R3.2
N$22
  Top 0.305: U1.12 49.11,33.72 47.25,31.87 C14.1
N$23
  Top 0.305: U1.1 55.75,32.27 C13.1
N$24  (via drill 0.35)
  Top 0.305: U1.11 48.79,34.38 v48.3,33.88 | v38.99,24.76 38.99,25.61 M1.4
  Bottom 0.305: v48.3,33.88 39.18,24.76 v38.99,24.76
N$25  (via drill 0.35)
  Top 0.305: U1.13 49.16,33.07 48.66,32.57 v48.66,31.97 | v37.33,24.59 37.33,25.4 M2.4
  Bottom 0.305: v48.66,31.97 47.41,31.97 39.37,23.93 37.93,23.93 37.33,24.53 v37.33,24.59
N$26
  Top 0.305: C15.2 55.6,38.67 R11.1 56.04,38.23 57.57,38.23 | R4.3 61.31,38.23 58.22,38.23 | 58.22,38.23 57.57,38.23 | 57.9,37.91 57.57,38.23 | U1.4 57.23,34.38 57.89,35.03 57.89,37.88 57.88,37.89 57.9,37.91 | 57.9,37.91 58.22,38.23
N$27
  Top 0.152: 4.87,62.67 4.84,62.67 2.84,64.67 U4.5 | 4.87,62.67 R26.2 | R31.1 4.87,60.7 4.87,62.67
N$28
  Top 0.305: J2.1 28.05,72.38 30.59,69.83 J9.2
N$29
  Top 0.152: R35.2 4.9,58.65 | 4.9,58.65 R34.1 | U4.6 5.86,63.75 5.76,63.64 5.76,59.46 4.95,58.65 4.9,58.65
N$30
  Top 0.305: J3.1 36.89,69.31 39.43,71.85 J8.2
N$31  (via drill 0.35)
  Top 0.152: U4.7 4.75,65.17 v4.69,65.12 | v7.75,54.67 R36.2 R37.1
  Bottom 0.152: v4.69,65.12 5.75,64.06 5.75,56.17 7.25,54.67 v7.75,54.67
N$32  (via drill 0.35)
  Top 0.305: R25.2 v54.75,77.17
  Bottom 0.152: LED3.A 54.84,88.18
  Bottom 0.305: v54.75,77.17 53.75,78.17 53.75,86.17 54.84,87.27 54.84,88.18
N$33  (via drill 0.35)
  Top 0.305: R22.2 38.75,55.49 v38.75,56.17
  Bottom 0.305: v38.75,56.17 38.75,61.17 41.25,63.67 41.25,79.17 50.25,88.17 50.26,88.18 50.38,88.31 LED2.A
N$34  (via drill 0.35)
  Top 0.305: R19.2 53.14,79.17 47.97,79.17 44.97,82.17 v42.75,82.17
  Bottom 0.305: v42.75,82.17 42.75,84.17 45.67,87.09 LED1.A
N$35
  Top 0.152: U11.SENSE 89.8,23.17 89.94,23.31 90.45,23.31 90.78,23.64 90.78,23.77
  Top 0.203: R38.2 92.44,35.83 92.44,32.87 91.35,31.77 91.28,31.77 | 91.28,31.77 92.45,30.6 92.45,28.67 91.45,27.67 U5.2 91.45,25.48 90.78,24.81 90.78,23.77 | 91.28,31.77 C40.1
N$36
  Top 0.203: U5.3 90.75,28.67 91.59,29.51 R40.1
N$37
  Top 0.203: U9.OUT 72.93,5.68 72.81,5.56 | 72.81,5.56 72.71,5.46 | 72.71,5.46 U12.1 | R39.1 72.81,3.27 72.81,5.36 | 72.71,5.46 72.81,5.36 | 72.81,5.36 72.81,5.56
N$38
  Top 0.203: U12.3 68.6,6.17 R41.1
N$39
  Top 0.203: U12.2 71.3,6.88 70.71,6.28 70.71,5.6 68.85,3.74 C41.1 66.6,3.17 R42.2 66.1,2.73 64.93,3.9 63.51,3.9 62.69,4.72 U14.SENSE
P_GATES
  Top 0.203: C30.2 69.99,11.32 R15.2 71.86,13.5 | Q3.1 71.86,14.82 71.86,13.5 | R27.2 75.45,12.47 74.42,13.5 71.86,13.5
P_GATES_MOTOR
  Top 0.203: R5.2 C3.2 88.05,35.35 R28.2 87.21,37.85 87.21,39.95 Q7.1
  Top 0.305: Q7.1 88.21,43.63 88.75,44.17 100.35,44.17 | Q9.1 113.21,40.21 113.25,40.17 113.25,43.67 112.75,44.17 101.07,44.17 | 100.35,44.17 100.75,44.17 | 100.75,44.17 101.07,44.17 | Q8.1 100.71,43.81 | 100.71,43.81 100.71,44.13 100.75,44.17 | 100.35,44.17 100.71,43.81 | 100.71,43.81 101.07,44.17
PS_IN
  Top 0.203: U3.1 52.52,73.04 51.85,73.72
  Top 0.305: J1.1 48.75,74.67 43.75,74.67 36.75,81.67 12.75,81.67 8.75,77.67 8.75,67.33 6.87,65.44 6.87,62.94 R26.1
  pour Top (no thermals): 44.75,67.72 44.75,69.17 45.35,69.77 45.35,74.69 47.4,76.73 51.04,76.73 52.58,75.19 52.58,73.06 50.17,73.06 49.89,72.78 49.89,69.66 47.94,67.72
S_N_GATE
  Top 0.203: R14.1 69.91,9.59 U6.1 72.16,9.59 72.72,9.03 72.72,8.5 73.05,8.17 75.15,8.17 R16.1 | R14.1 | U14.OUT 63.07,6.62 66.68,10.23 R14.1
SCL
  Top 0.152: J10.2 12.91,84.33 7.25,78.67 7.25,67.66 6.27,66.67 U4.10 5.49,66.67 5.34,66.83 5.34,71.34 4.51,72.17 R23.2
SDA
  Top 0.152: J10.1 58.12,83.73 57.3,82.91 12.98,82.91 8.25,78.17 8.25,67.67 6.75,66.17 U4.9 5.23,66.17 4.85,66.55 4.85,69.8 4.47,70.17 R24.2
SW1
  Top 0.305: C26.2 9.35,32.09 10.63,33.36 12.23,33.36 12.71,33.84 12.71,35.11 13.14,35.55 13.85,35.55 14.17,35.22 U2.10 15.68,35.22 15.94,35.48 15.94,36.27 16.15,36.48 16.15,39.48 R8.1
  pour Top (no thermals): 2.7,35.05 7.23,35.05 7.23,34.17 8.79,32.61 9.8,32.61 9.8,30.94 9.01,30.15 9.01,26.68 8.95,26.62 8.08,26.62 7.62,27.08 2.85,27.08 2.81,27.12 2.81,30.93 2.68,31.06 2.68,35.05
SW2  (via drill 0.35)
  Top 0.305: U1.10 48.48,35.02 v47.31,33.86 | v43.14,33.94 43.4,33.67 R3.1
  Bottom 0.305: v47.31,33.86 47.24,33.94 v43.14,33.94
  pour Top (no thermals): 33.5,34.17 33,33.67 33,26.45 33.08,26.37 37.89,26.37 38.16,26.64 39.21,26.64 39.32,26.75 39.32,30.11 40.11,30.9 44.75,30.9 44.89,31.04 44.89,34.27 44.86,34.3 33.62,34.3 33.52,34.2
SYSTEM_IN  (5 unrouted)
  Top 0.203: 87.53,9.52 87.53,9.27 87.47,9.2 | 87.53,9.52 87.53,13.03 87.3,13.27 Q2.8 | 87.35,9.08 86.97,8.7 U8.8 85.52,6.91 84.38,5.77 R21.2 | 87.35,9.08 87.47,9.2 | U8.7 87.25,9.35 | 87.25,9.35 87.31,9.35 | 87.31,9.35 87.47,9.2 | 87.25,9.35 87.35,9.25 87.35,9.08 | 87.31,9.35 87.36,9.35 87.53,9.52 | U3.8 52.52,65.95 52.25,65.67 51.88,66.05 U3.7 | R27.1 78.28,11.57 C29.1
  Top 0.305: 44.93,65.25 Q1.9 | R25.1 54.75,66.67 | 54.75,66.67 54.75,64.44 | 54.75,66.67 54.21,66.13 54.14,66.13 | 54.75,66.67 55.25,66.17
  Top 0.508: U13.3 55.15,59.83 | 55.15,59.83 55.15,62.24 | 55.15,62.24 57.35,64.44 54.75,64.44 | 55.15,62.24 54.68,62.7 | C38.1 54.53,59.83 55.15,59.83
  Top 0.762: C1.1 43.84,60.77 Q1.5 | C2.1 47.66,60.73 Q1.8
  Top 1.27: 48.51,65.17 49.25,64.44
  Top 3.81: Q1.9 49.25,64.44 54.75,64.44 57.99,64.44 83.25,39.17 83.25,18.17 | 85.75,15.67 83.25,18.17 | 83.25,18.17 80.25,15.17 84.7,15.17 Q2.6
  pour Top (no thermals): 89.25,17.17 76.25,17.17 76.25,13.14 78.22,11.17 83.75,11.17 85.75,13.17 89.25,13.17
SYSTEM_PULLUP  (via drill 0.35)
  Top 0.305: J2.2 30.61,76.25 J8.1 36.89,71.31 35.25,69.67 35.25,62.17 42.75,54.67 62.25,54.67 79.2,37.72 79.2,32.85 80.25,31.8 80.25,19.17 79.75,18.67 71.75,18.67 70.25,17.17 v70.25,16.17 | v70.25,8.67 70.12,8.54 R14.2
  Bottom 0.305: v70.25,16.17 v70.25,8.67
SYSTEM_SWITCHED
  Top 0.203: C30.1 69.26,15.16 66.75,17.67 74.75,25.67 74.75,25.28 Q3.4
  Top 2: L4.1 27.59,28.77 30.48,31.66 30.48,42.94 28.75,44.67 23.75,44.67 22.25,46.17 22.25,47.17 22.25,47.63 | 22.25,47.63 JP1.7 JP1.5 22.25,47.63
  pour Top (no thermals): 69.25,29.67 65.25,25.67 61.25,25.67 61.25,16.17 65.25,16.17 69.25,20.17 79.25,20.17 79.25,29.67
  pour Top (no thermals): 63.69,25.6 54.88,25.6 54.88,28.42 53.71,28.42 53.71,25.22 50.91,22.67 33,22.67 29.75,25.67 29.75,29.42 28.25,30.92 26.5,30.92 26.25,30.67 26.25,26.67 22.25,22.67 8.68,22.67 7.04,21.03 7.04,17.47 8.34,16.17 63.69,16.17
V_ADJ  (via drill 0.35)
  Top 0.305: R35.1 v7.75,56.67 | R22.1 37.37,55.17 35.75,55.17 | R11.2 53.8,40.42 C15.1 53.75,42.17 52.75,43.17 46.75,43.17 42.45,38.88 C16.P$1
  Top 2: 35.75,50.02 35.75,55.17 35.75,57.67 32.75,60.67 21.75,60.67 19.25,63.17 | 35.75,50.02 35.75,47.79 | 35.75,47.79 35.75,40.79 L1.2 | 19.25,63.17 18.52,63.91 18.52,64.64 | 18.52,64.64 J7.1 | J7.1 18.52,65.7 | 18.52,67.17 18.52,75.64 J4.1 | 18.52,67.17 18.52,65.7 | 18.52,65.7 18.52,64.64 | 19.25,63.17 19.25,64.97 | 19.25,64.97 J7.1 | 18.52,67.17 19.25,66.44 19.25,64.97 | 35.75,50.02 34.64,48.91 | 34.64,48.91 30.25,48.91 | 30.25,48.91 JP1.11 JP1.9 26.79,48.17 29.52,48.17 30.25,48.91 | 34.64,48.91 35.75,47.79
  Bottom 0.305: v7.75,56.67 12.75,56.67 19.05,62.97 J7.1
  pour Top (no thermals): 33.5,41.06 33.5,38.67 34.36,37.81 43.49,37.81 43.7,38.02 43.7,39.32 41.48,41.54 33.98,41.54
V_BATT_FILTERED_1  (via drill 0.35)
  Top 0.305: U2.2 21.45,33.27 22.11,33.94 v22.95,33.94 25.89,33.94 26.75,33.07 R6.1 | R7.1 v19.55,41.56 v19.56,41.57
  Top 0.508: R6.1 26.75,32.52 24.35,30.12 L4.2
  Bottom 0.305: v19.56,41.57 22.95,38.19 v22.95,33.94
  pour Top (no thermals): 25.14,30.95 15.5,30.95 14.58,30.03 9.81,30.03 9.59,29.81 9.59,25.54 9.72,25.41 15.3,25.41 16.32,26.43 17.77,26.43 18.37,27.03 22.32,27.03 22.74,26.61 25.16,26.61 25.16,30.93
V_BATT_FILTERED_2  (via drill 0.35)
  Top 0.305: 56.37,33.07 U1.2 | 56.8,32.64 56.8,29.84 R1.1 52.97,29.09 51.93,28.05 51.93,27.01 L3.2 | 56.8,32.64 56.63,32.81 | 56.63,32.81 56.37,33.07 | R2.1 v51.75,41.67 | v57.25,33.42 56.87,33.05 | 56.87,33.05 56.8,32.97 | 56.63,32.81 56.8,32.97 | 56.8,32.97 56.8,32.64 | 56.87,33.05 56.84,33.07 56.37,33.07
  Bottom 0.305: v51.75,41.67 57.25,36.17 v57.25,33.42
  pour Top (no thermals): 52.5,25.17 51.67,25.17 51.08,25.76 50.15,25.76 49.36,26.55 46.12,26.55 44.97,25.4 40.05,25.4 39.96,25.49 39.96,29.84 40.07,29.95 51.77,29.95 52.83,28.89 52.83,25.45 52.57,25.19
(copper drawn outside any net)
  shapes: Top area x1131

## Text on the board
tPlace: GND | V+ | 5V / Output | Adj. / Output | Motor / E-STOP | System / E-STOP | GND / GND / GND / GND / GND / GND | MUV | SUV | 5V / 5V / VIN / VIN / ADJ / ADJ | ADJ / REG | 42V | GND | GND tied / to Chassis / when Jumper / connected | RoboDesign Lab Tello Power PCB
bPlace: 5V / Output | Adj. / Output | Motor / E-STOP | System / E-STOP | 5v | Adj. | Sys. | Mtrs | Motors | Motors | Motors | Motors | 5v | GND | Adj. | GND | 5V / Output | System / E-STOP | Adj. / Output | Motor / E-STOP | 42v MAX | 5v | GND | Adj. | GND | Features: / / - Adj. System Under Voltage Protection / - Adj. Motor Under Voltage Protection / - 5v Regulated Output / - Adj. Regulated Output / - Hot Swapping between Battery & Power Supply / - I2C ADC Voltage Sensing: / - Battery Voltage / - Power Supply Voltage / - Motor Voltage / - Adj. Reg. Voltage / - Expansion Ports: / - Additional XT30 Motor Ports / - Additional Regulated Power Ports | 42v MAX | GND